# EasyEDA Pro project f407拓展.eprj

# Schematic Schematic1
Create Date: 2024-04-14; Page Name: P1; Project Name: f407拓展; Schematic Name: Schematic1; Update Date: 2024-04-14; Company: 嘉立创EDA; Page Size: A4; Version: V1.0
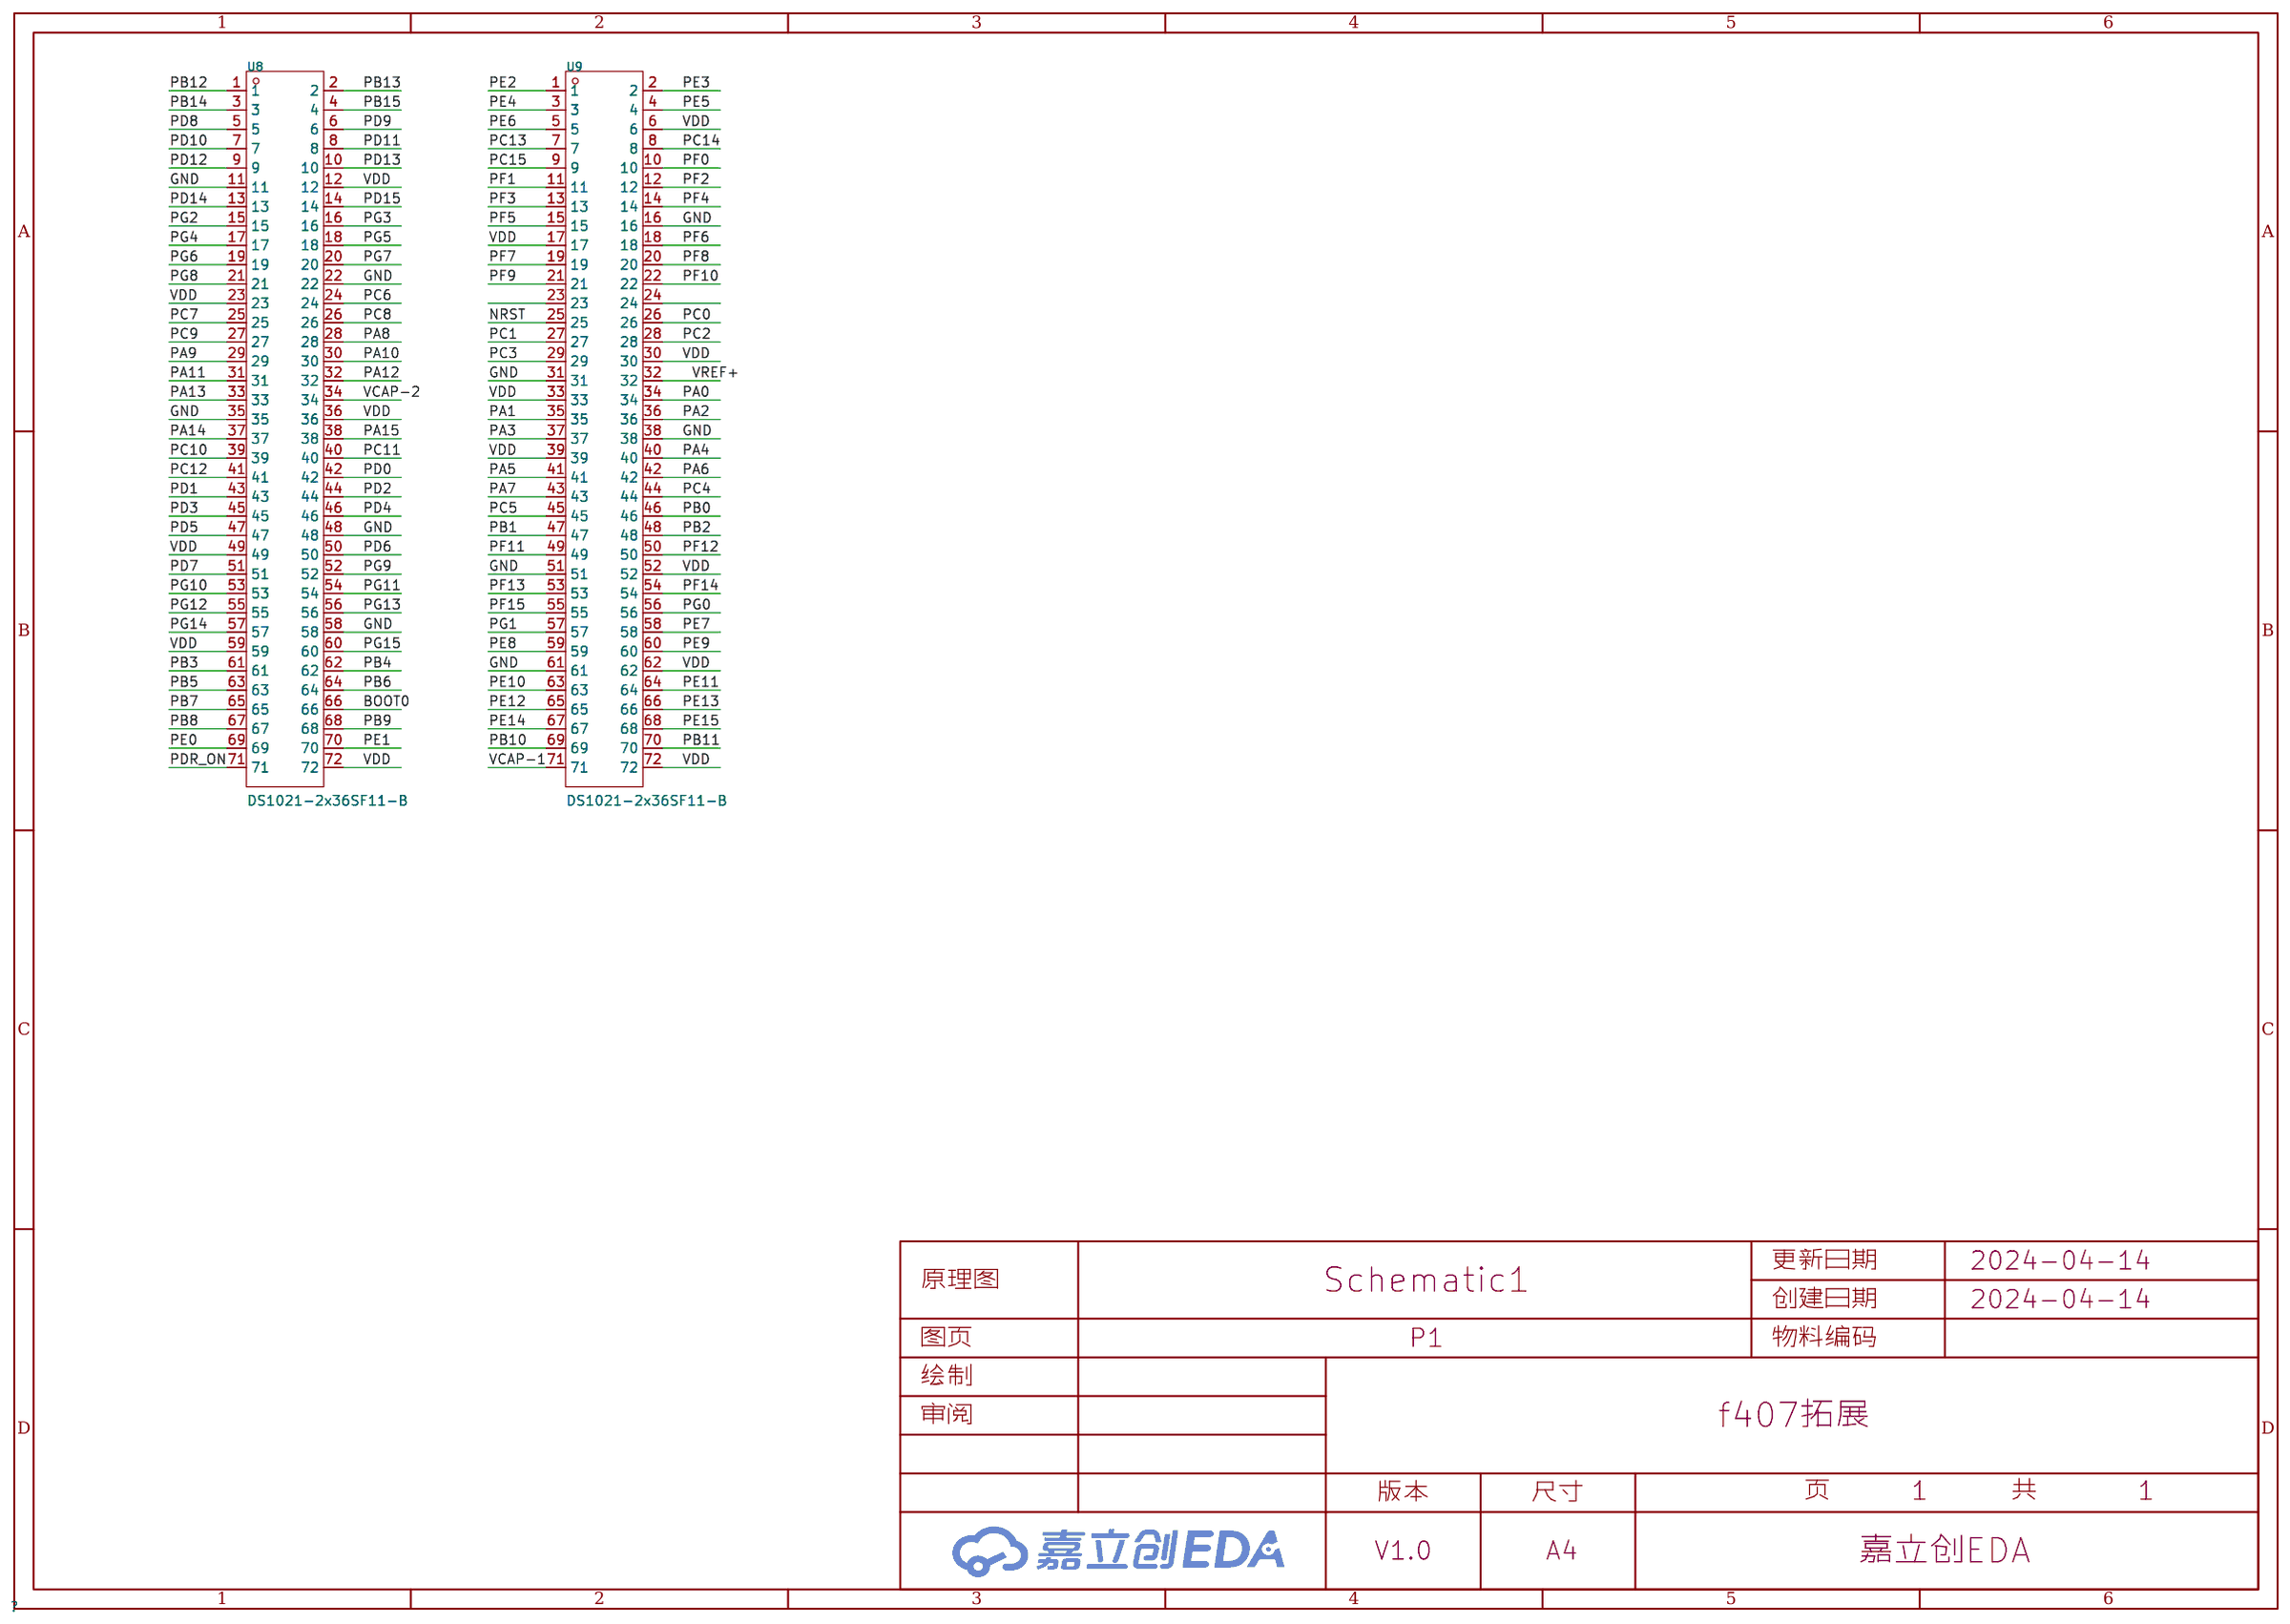
[diagram p0: schematic sheet]

## Parts
U8  DS1021-2x36SF11-B  [HDR-TH_72P-P2.54-V-M-R2-C36-S2.54]
U9  DS1021-2x36SF11-B  [HDR-TH_72P-P2.54-V-M-R2-C36-S2.54]

## Library data of the parts
U8 U9 = DS1021-2x36SF11-B: 插针结构:2x36P;间距:2.54mm;安装类型:直插;排数:双排;总PIN位数:72P;; LCSC Part Name: 2x36P 间距:2.54mm 直插; Supplier Part: C7430432; Manufacturer: CONNFLY; Supplier Footprint: 插件,P=2.54mm; Datasheet: https://atta.szlcsc.com/upload/public/pdf/source/20230721/045F128FE19DC325F71FA0C1C07679E3.pdf; Supplier: LCSC; Pin Structure: 2x36P; Pitch: 2.54mm; Mounting Type: 直插; Number of Rows: 双排; Number of Pins: 72P

## Nets
GND: U8.11 U8.22 U8.35 U8.48 U8.58 U9.16 U9.31 U9.38 U9.51 U9.61
VDD: U8.12 U8.23 U8.36 U8.49 U8.59 U8.72 U9.6 U9.17 U9.30 U9.33 U9.39 U9.52 U9.62 U9.72
BOOT0: U8.66
NRST: U9.25
PA0: U9.34
PA1: U9.35
PA2: U9.36
PA3: U9.37
PA4: U9.40
PA5: U9.41
PA6: U9.42
PA7: U9.43
PA8: U8.28
PA9: U8.29
PA10: U8.30
PA11: U8.31
PA12: U8.32
PA13: U8.33
PA14: U8.37
PA15: U8.38
PB0: U9.46
PB1: U9.47
PB2: U9.48
PB3: U8.61
PB4: U8.62
PB5: U8.63
PB6: U8.64
PB7: U8.65
PB8: U8.67
PB9: U8.68
PB10: U9.69
PB11: U9.70
PB12: U8.1
PB13: U8.2
PB14: U8.3
PB15: U8.4
PC0: U9.26
PC1: U9.27
PC2: U9.28
PC3: U9.29
PC4: U9.44
PC5: U9.45
PC6: U8.24
PC7: U8.25
PC8: U8.26
PC9: U8.27
PC10: U8.39
PC11: U8.40
PC12: U8.41
PC13: U9.7
PC14: U9.8
PC15: U9.9
PD0: U8.42
PD1: U8.43
PD2: U8.44
PD3: U8.45
PD4: U8.46
PD5: U8.47
PD6: U8.50
PD7: U8.51
PD8: U8.5
PD9: U8.6
PD10: U8.7
PD11: U8.8
PD12: U8.9
PD13: U8.10
PD14: U8.13
PD15: U8.14
PDR_ON: U8.71
PE0: U8.69
PE1: U8.70
PE2: U9.1
PE3: U9.2
PE4: U9.3
PE5: U9.4
PE6: U9.5
PE7: U9.58
PE8: U9.59
PE9: U9.60
PE10: U9.63
PE11: U9.64
PE12: U9.65
PE13: U9.66
PE14: U9.67
PE15: U9.68
PF0: U9.10
PF1: U9.11
PF2: U9.12
PF3: U9.13
PF4: U9.14
PF5: U9.15
PF6: U9.18
PF7: U9.19
PF8: U9.20
PF9: U9.21
PF10: U9.22
PF11: U9.49
PF12: U9.50
PF13: U9.53
PF14: U9.54
PF15: U9.55
PG0: U9.56
PG1: U9.57
PG2: U8.15
PG3: U8.16
PG4: U8.17
PG5: U8.18
PG6: U8.19
PG7: U8.20
PG8: U8.21
PG9: U8.52
PG10: U8.53
PG11: U8.54
PG12: U8.55
PG13: U8.56
PG14: U8.57
PG15: U8.60
VCAP-1: U9.71
VCAP-2: U8.34
VREF+: U9.32

Not connected (* = marked no-connect by the designer): U9 23 24

# Board PCB1
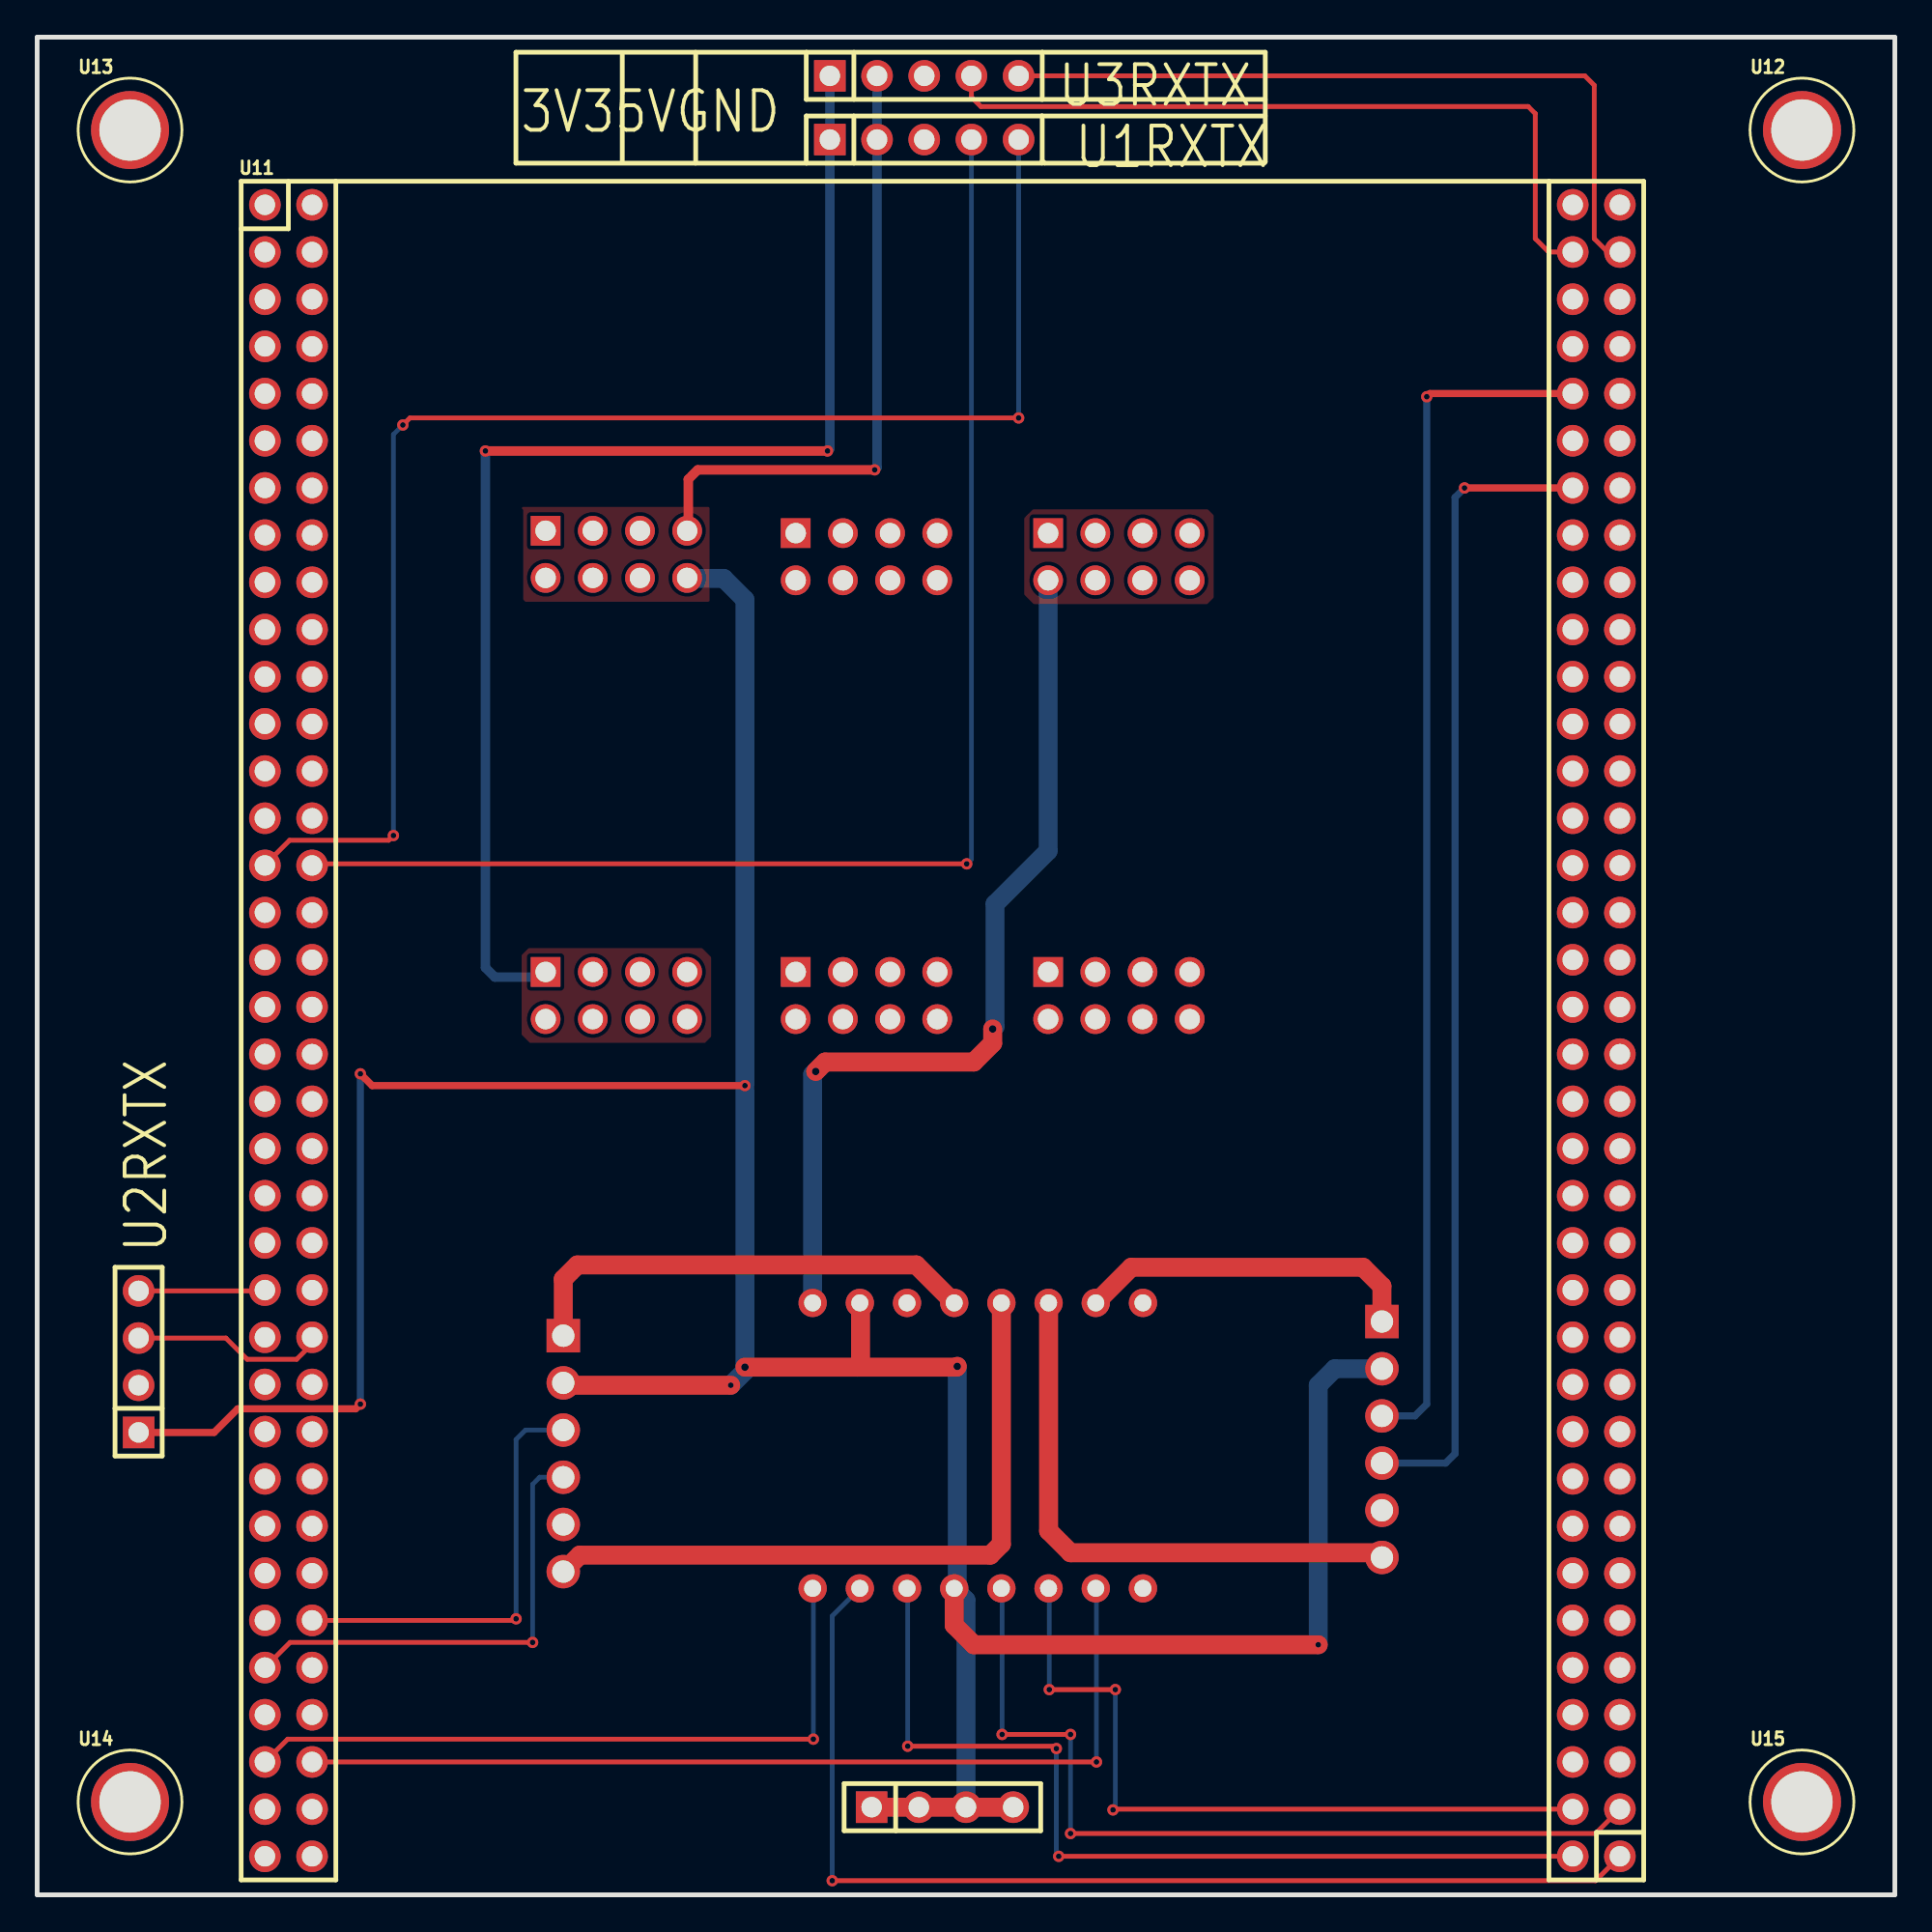
[diagram p1: board, top side]
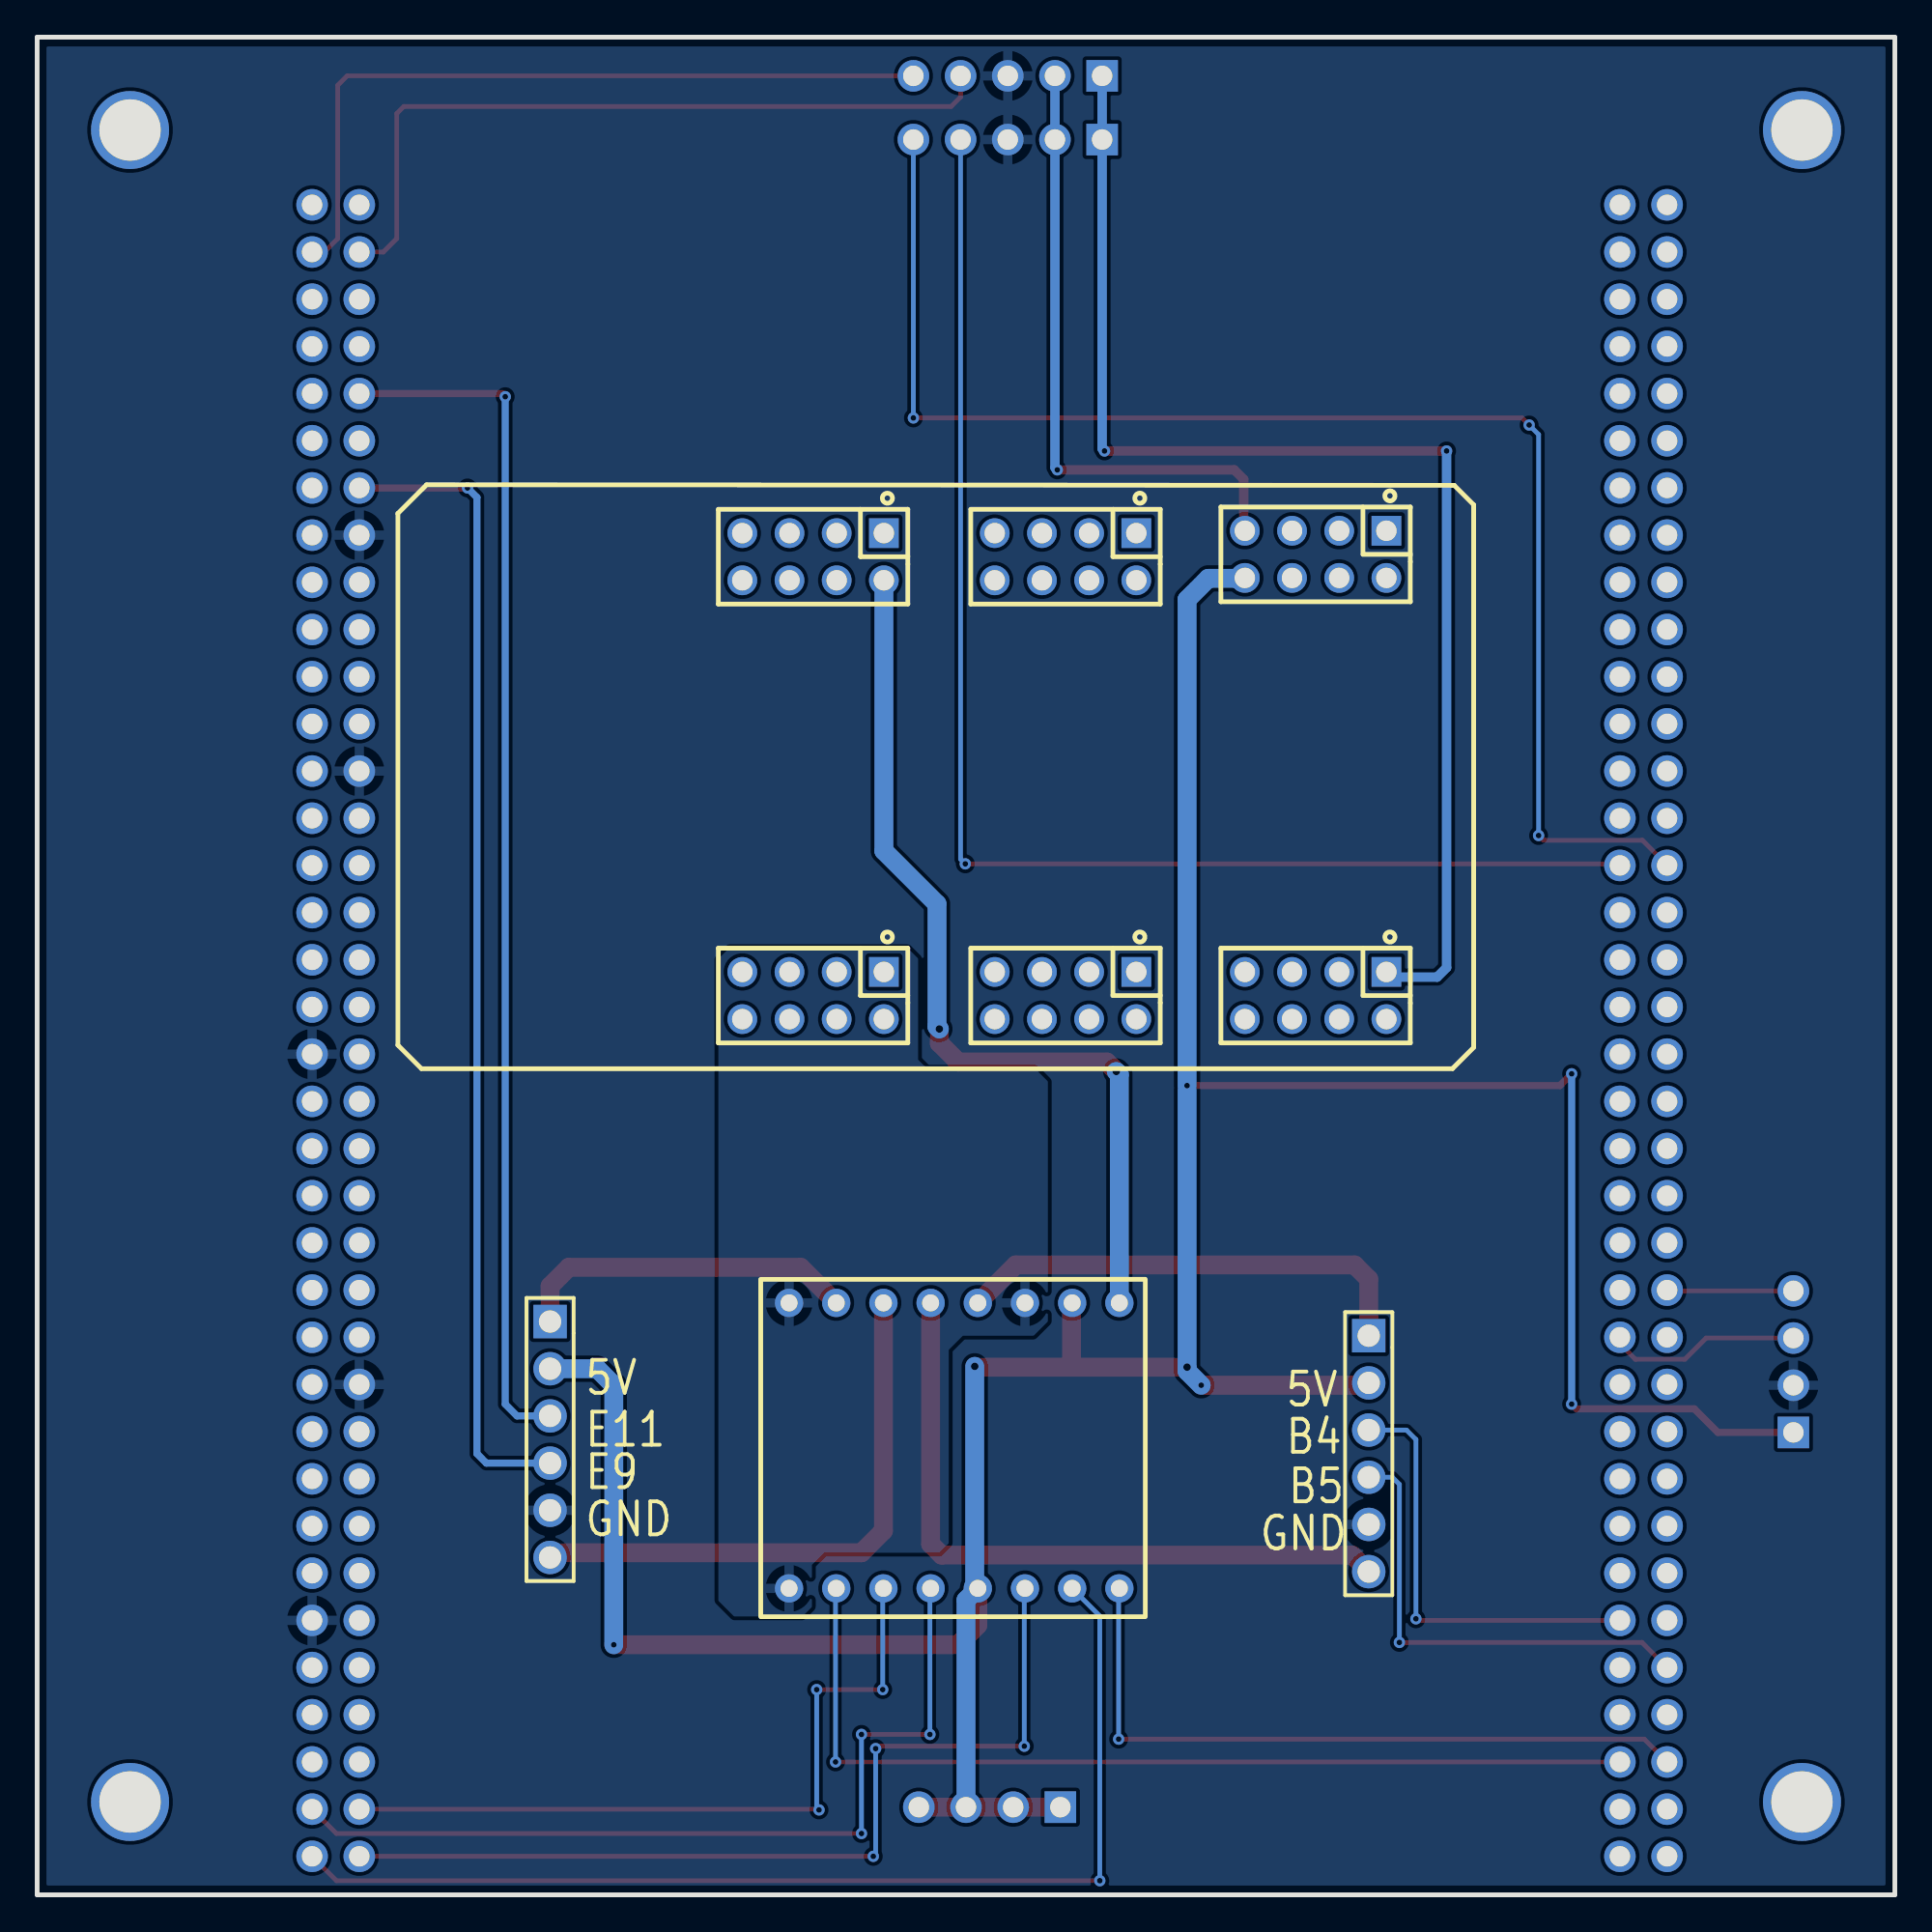
[diagram p2: board, bottom side, seen from below]

Outline 100 x 100 mm; copper layers: Top Layer, Bottom Layer. Coordinates in mm from the lower left corner of the outline.
Outline path: 0,100 100,100 100,0 0,0 0,100
Stack: Top Layer 0.035mm / Dielectric1 1.51mm FR4 er 4.5 / Bottom Layer 0.035mm

## Design rules (mm)
template: 自定义配置
spacing copperThickness1oz (default): track to track 0.102, other pairs 0.152 to 0.3
spacing copperThickness2oz: track to track 0.203, other pairs 0.152 to 0.3
track width copperThickness1oz (default): min 0.127, default 0.254, max 2.54
track width copperThickness2oz: min 0.203, default 0.254, max 2.54
differential pair differentialPair (default): width min 0.127, default 0.254, max 2.54; gap min 0.152, default 0.152
via viaSize (default): diameter min 0.5, default 0.61, max 10; hole min 0.3, default 0.305, max 6.3

## Placement (name value [footprint] x y rotation side)
H1  -  [HDR-TH_4P-P2.54-V-M]  5.46 28.7 90 top
H2  -  [HDR-TH_6P-P2.54-V-M-1]  28.32 23.75 270 bottom
H3  -  [HDR-TH_6P-P2.54-V-M-1]  72.39 24.51 270 bottom
H4  -  [HDR-TH_5P-P2.54-V-M]  47.75 97.92 0 top
H5  -  [HDR-TH_5P-P2.54-V-M]  47.75 94.49 0 top
U9  DS1021-2x36SF11-B  [TB6612]  50 24.75 270 bottom
U10  -  [电源v2.0]  50 60.2 180 bottom
U11  -  [f407]  50 45 0 top
U12  M3*12+3  [TH_BD4.7-D3.0]  95 95 0 top
U13  M3*12+3  [TH_BD4.7-D3.0]  5 95 0 top
U14  M3*12+3  [TH_BD4.7-D3.0]  5 5 0 top
U15  M3*12+3  [TH_BD4.7-D3.0]  95 5 0 top

## Footprints (pads in the part's own frame, mm; a bottom-side part is the same pattern mirrored in y, then rotated)
f407
  round 1.7 hole 1.1: 1(-37.74,45.974) 1(35.2,-42.926) 2(-35.2,45.974) 2(-2.54,-40.281) 2(32.66,-42.926) 3(-37.74,43.434) 3(0,-40.281) 3(35.2,-40.386) 4(-35.2,43.434) 4(2.54,-40.281) 4(32.66,-40.386) 5(-37.74,40.894) 5(35.2,-37.846) 6(-35.2,40.894) 6(32.66,-37.846) 7(-37.74,38.354) 7(35.2,-35.306) 8(-35.2,38.354) 8(32.66,-35.306) 9(-37.74,35.814) 9(35.2,-32.766) 10(-35.2,35.814) 10(32.66,-32.766) 11(-37.74,33.274) 11(35.2,-30.226) 12(-35.2,33.274) 12(32.66,-30.226) 13(-37.74,30.734) 13(35.2,-27.686) 14(-35.2,30.734) 14(32.66,-27.686) 15(-37.74,28.194) 15(35.2,-25.146) 16(-35.2,28.194) 16(32.66,-25.146) 17(-37.74,25.654) 17(35.2,-22.606) 18(-35.2,25.654) 18(32.66,-22.606) 19(-37.74,23.114) 19(35.2,-20.066) 20(-35.2,23.114) 20(32.66,-20.066) 21(-37.74,20.574) 21(35.2,-17.526) 22(-35.2,20.574) 22(32.66,-17.526) 23(-37.74,18.034) 23(35.2,-14.986) 24(-35.2,18.034) 24(32.66,-14.986) 25(-37.74,15.494) 25(35.2,-12.446) 26(-35.2,15.494) 26(32.66,-12.446) 27(-37.74,12.954) 27(35.2,-9.906) 28(-35.2,12.954) 28(32.66,-9.906) 29(-37.74,10.414) 29(35.2,-7.366) 30(-35.2,10.414) 30(32.66,-7.366) 31(-37.74,7.874) 31(35.2,-4.826) 32(-35.2,7.874) 32(32.66,-4.826) 33(-37.74,5.334) 33(35.2,-2.286) 34(-35.2,5.334) 34(32.66,-2.286) 35(-37.74,2.794) 35(35.2,0.254) 36(-35.2,2.794) 36(32.66,0.254) 37(-37.74,0.254) 37(35.2,2.794) 38(-35.2,0.254) 38(32.66,2.794) 39(-37.74,-2.286) 39(35.2,5.334) 40(-35.2,-2.286) 40(32.66,5.334) 41(-37.74,-4.826) 41(35.2,7.874) 42(-35.2,-4.826) 42(32.66,7.874) 43(-37.74,-7.366) 43(35.2,10.414) 44(-35.2,-7.366) 44(32.66,10.414) 45(-37.74,-9.906) 45(35.2,12.954) 46(-35.2,-9.906) 46(32.66,12.954) 47(-37.74,-12.446) 47(35.2,15.494) 48(-35.2,-12.446) 48(32.66,15.494) 49(-37.74,-14.986) 49(35.2,18.034) 50(-35.2,-14.986) 50(32.66,18.034) 51(-37.74,-17.526) 51(35.2,20.574) 52(-35.2,-17.526) 52(32.66,20.574) 53(-37.74,-20.066) 53(35.2,23.114) 54(-35.2,-20.066) 54(32.66,23.114) 55(-37.74,-22.606) 55(35.2,25.654) 56(-35.2,-22.606) 56(32.66,25.654) 57(-37.74,-25.146) 57(35.2,28.194) 58(-35.2,-25.146) 58(32.66,28.194) 59(-37.74,-27.686) 59(35.2,30.734) 60(-35.2,-27.686) 60(32.66,30.734) 61(-37.74,-30.226) 61(35.2,33.274) 62(-35.2,-30.226) 62(32.66,33.274) 63(-37.74,-32.766) 63(35.2,35.814) 64(-35.2,-32.766) 64(32.66,35.814) 65(-37.74,-35.306) 65(35.2,38.354) 66(-35.2,-35.306) 66(32.66,38.354) 67(-37.74,-37.846) 67(35.2,40.894) 68(-35.2,-37.846) 68(32.66,40.894) 69(-37.74,-40.386) 69(35.2,43.434) 70(-35.2,-40.386) 70(32.66,43.434) 71(-37.74,-42.926) 71(35.2,45.974) 72(-35.2,-42.926) 72(32.66,45.974)
  rect 1.7x1.7 hole 1.1: 1(-5.08,-40.281)
HDR-TH_4P-P2.54-V-M
  rect 1.7x1.7 hole 1.1: 1(-3.81,0)
  round 1.7 hole 1.1: 2(-1.27,0) 3(1.27,0) 4(3.81,0)
HDR-TH_5P-P2.54-V-M
  rect 1.7x1.7 hole 1.1: 1(-5.08,0)
  round 1.7 hole 1.1: 2(-2.54,0) 3(0,0) 4(2.54,0) 5(5.08,0)
HDR-TH_6P-P2.54-V-M-1
  rect 1.8x1.8 hole 1.2: 1(-6.35,0)
  round 1.8 hole 1.2: 2(-3.81,0) 3(-1.27,0) 4(1.27,0) 5(3.81,0) 6(6.35,0)
TB6612
  round 1.524 hole 0.914: 1(-7.112,8.255) 2(-7.112,5.715) 3(-7.112,3.175) 4(-7.112,0.635) 5(-7.112,-1.905) 6(-7.112,-4.445) 7(-7.112,-6.985) 8(-7.112,-9.525) 9(8.255,-9.525) 10(8.255,-6.985) 11(8.255,-4.445) 12(8.255,-1.905) 13(8.255,0.635) 14(8.255,3.175) 15(8.255,5.715) 16(8.255,8.255)
TH_BD4.7-D3.0
  round 4.2 hole 3.3: 1(0,0)
电源v2.0
  rect 1.6x1.6 hole 1.1: 1(-4.421,-10.518) 1(-4.421,13.104) 1(9.168,-10.518) 1(9.168,13.104) 1(22.63,-10.518) 1(22.63,13.232)
  round 1.6 hole 1.1: 2(-4.421,-13.057) 2(-4.421,10.565) 2(9.168,-13.057) 2(9.168,10.565) 2(22.63,-13.057) 2(22.63,10.691) 3(-6.962,-10.518) 3(-6.962,13.104) 3(6.628,-10.518) 3(6.628,13.104) 3(20.09,-10.518) 3(20.09,13.232) 4(-6.962,-13.057) 4(-6.962,10.565) 4(6.628,-13.057) 4(6.628,10.565) 4(20.09,-13.057) 4(20.09,10.691) 5(-9.502,-10.518) 5(-9.502,13.104) 5(4.088,-10.518) 5(4.088,13.104) 5(17.549,-10.518) 5(17.549,13.232) 6(-9.502,-13.057) 6(-9.502,10.565) 6(4.088,-13.057) 6(4.088,10.565) 6(17.549,-13.057) 6(17.549,10.691) 7(-12.041,-10.518) 7(-12.041,13.104) 7(1.548,-10.518) 7(1.548,13.104) 7(15.009,-10.518) 7(15.009,13.232) 8(-12.041,-13.057) 8(-12.041,10.565) 8(1.548,-13.057) 8(1.548,10.565) 8(15.009,-13.057) 8(15.009,10.691)

## Nets
3V3: H4.1 H5.1
5V: H1.1 H2.2 H3.2 H4.2 H5.2 U9.2 U9.13 U10.1 U10.2 U10.3 U10.4 U10.5 U10.6 U10.7 U10.8 U11.1 U11.2 U11.3 U11.4
GND: H1.2 H2.5 H3.5 H4.3 H5.3 U11.11 U11.22 U11.35 U11.48 U11.58
PGND: U9.3 U9.8 U9.9
VCC: U9.1
AO1: H2.1 U9.4
AO2: H2.6 U9.5
BO1: H3.1 U9.7
BO2: H3.6 U9.6
PB4: H2.3 U11.62
PB5: H2.4 U11.63
PB8: U9.16 U11.67
PB9: U9.10 U11.68
PE2: U9.15
PE3: U9.14
PE4: U9.12
PE5: U9.11
PE9: H3.4
PE11: H3.3
U1RX: H5.4 U11.30
U1TX: H5.5 U11.29
U2RX: H1.3 U11.50
U2TX: H1.4 U11.47
U3RX: H4.4
U3TX: H4.5

Pads without a net: U11 5 6 7 8 9 10 12 13 14 15 16 17 18 19 20 21 23 24 25 26 27 28 31 32 33 34 36 37 38 39 40 41 42 43 44 45 46 49 51 52 53 54 55 56 57 59 60 61 64 65 66 69 70 71 72; U12 1; U13 1; U14 1; U15 1

## Via types
v1: diameter 0.965, hole 0.406, Top Layer to Bottom Layer, 4 vias
v2: diameter 0.61, hole 0.305, Top Layer to Bottom Layer, 28 vias

## Routing (per net, layer and track width the routed paths; a pad name or vN(x,y) marks a point on that pad's centre or on a via; arc(x,y) is an arc through that point)
3V3: length 70
  Top Layer w0.508: v2(42.54,77.72) v2(24.13,77.72)
  Bottom Layer w0.508: v2(24.13,77.72) 24.13,49.91 24.64,49.4 27.09,49.4 27.37,49.68 ; H4.1 H5.1 42.67,77.85 v2(42.54,77.72)
5V: length 227.1
  Top Layer w0.381: v2(38.1,43.56) 18.03,43.56 v2(17.4,44.2) ; H1.1 9.53,24.89 10.8,26.16 17.14,26.16 v2(17.4,26.42)
  Top Layer w0.508: U10.7 35.05,73.49 35.05,76.2 35.56,76.71 v2(45.09,76.71)
  Top Layer w1.016: 44.28,31.87 44.32,31.83 44.32,28.57 44.15,28.41 ; U11.1 U11.2 U11.3 U11.4 ; v1(49.53,28.45) 49.49,28.41 44.15,28.41 ; H2.2 28.45,27.43 v2(37.34,27.43) ; 44.15,28.41 v1(38.1,28.41) ; U9.13 49.37,14.52 50.42,13.46 v2(68.96,13.46)
  Bottom Layer w0.381: v2(17.4,44.2) v2(17.4,26.42)
  Bottom Layer w0.508: H4.2 H5.2 45.21,76.83 v2(45.09,76.71)
  Bottom Layer w1.016: v2(68.96,13.46) 68.96,27.43 69.85,28.32 H3.2 ; U11.3 50,15.86 U9.13 49.53,16.66 v1(49.53,28.45) ; 38.1,43.31 v1(38.1,28.41) 38.1,28.19 v2(37.34,27.43) ; v2(38.1,43.56) 38.1,69.72 36.96,70.87 35.01,70.87 U10.8
VCC: length 48.8
  Top Layer w1.016: v1(51.44,46.61) 51.44,45.85 50.42,44.83 42.42,44.83 v1(41.91,44.32)
  Bottom Layer w1.016: v1(41.91,44.32) 41.75,44.16 41.75,31.87 ; v1(51.44,46.61) 51.56,46.74 51.56,53.34 54.42,56.2 54.42,70.76
AO1: length 25.3
  Top Layer w1.016: 49.37,31.87 47.32,33.91 29.08,33.91 28.32,33.15 H2.1
AO2: length 37.2
  Top Layer w1.016: H2.6 29.21,18.29 51.31,18.29 51.91,18.88 51.91,31.87
BO1: length 18.5
  Top Layer w1.016: H3.1 72.39,32.77 71.37,33.78 58.9,33.78 56.99,31.87
BO2: length 30.8
  Top Layer w1.016: 54.44,31.87 54.44,19.6 55.63,18.41 72.14,18.41 H3.6
PB4: length 23.4
  Top Layer w0.254: v2(25.78,14.86) 25.7,14.77 U11.62
  Bottom Layer w0.254: H2.3 26.29,25.02 25.78,24.51 v2(25.78,14.86)
PB5: length 25.3
  Top Layer w0.254: v2(26.67,13.59) 13.61,13.59 U11.63
  Bottom Layer w0.254: v2(26.67,13.59) 26.67,22.1 27.05,22.48 28.32,22.48
PB8: length 38.2
  Top Layer w0.254: U11.67 13.49,8.38 v2(41.78,8.38)
  Bottom Layer w0.254: v2(41.78,8.38) 41.78,16.46 U9.16
PB9: length 51.6
  Top Layer w0.254: U11.68 v2(57.02,7.15)
  Bottom Layer w0.254: U9.10 57.02,16.46 v2(57.02,7.15)
PE2: length 59.3
  Top Layer w0.254: 85.2,2.07 83.89,0.76 v2(42.8,0.76)
  Bottom Layer w0.254: v2(42.8,0.76) 42.8,15.01 U9.15
PE3: length 50.1
  Top Layer w0.254: v2(54.86,7.87) 54.74,8 v2(46.86,8) ; 82.66,2.07 v2(54.99,2.07)
  Bottom Layer w0.254: U9.14 46.86,16.46 v2(46.86,8) ; v2(54.86,7.87) 54.86,2.2 v2(54.99,2.07)
PE4: length 47
  Top Layer w0.254: 85.2,4.61 83.89,3.3 v2(55.63,3.3) ; v2(55.63,8.64) v2(51.94,8.64)
  Bottom Layer w0.254: v2(55.63,3.3) v2(55.63,8.64) ; v2(51.94,8.64) 51.94,16.46
PE5: length 40.3
  Top Layer w0.254: 82.66,4.61 57.95,4.61 v2(57.91,4.57) ; v2(58.04,11.05) v2(54.48,11.05)
  Bottom Layer w0.254: v2(58.04,11.05) 58.04,4.7 v2(57.91,4.57) ; U9.11 54.48,16.46 v2(54.48,11.05)
PE9: length 62.2
  Top Layer w0.381: 82.66,75.73 v2(76.84,75.73)
  Bottom Layer w0.381: H3.4 75.82,23.24 76.33,23.75 76.33,75.23 v2(76.84,75.73)
PE11: length 64.8
  Top Layer w0.381: v2(74.8,80.64) 74.97,80.81 82.66,80.81
  Bottom Layer w0.381: v2(74.8,80.64) 74.8,26.42 74.17,25.78 H3.3
U1RX: length 74.4
  Top Layer w0.254: v2(50.04,55.5) 14.89,55.5 U11.30
  Bottom Layer w0.254: H5.4 50.29,55.75 v2(50.04,55.5)
U1TX: length 78.2
  Top Layer w0.254: U11.29 12.26,55.44 13.59,56.77 18.92,56.77 v2(19.18,57.02) ; v2(52.83,79.5) 20.07,79.5 v2(19.69,79.12)
  Bottom Layer w0.254: v2(52.83,79.5) H5.5 ; v2(19.18,57.02) 19.18,78.61 v2(19.69,79.12)
U2RX: length 10.5
  Top Layer w0.254: U11.50 14.8,29.66 13.97,28.83 11.3,28.83 10.16,29.97 H1.3
U2TX: length 6.8
  Top Layer w0.254: H1.4 12.22,32.51 U11.47
U3RX: length 40.9
  Top Layer w0.254: 82.66,88.43 81.37,88.43 80.65,89.15 80.65,95.89 80.26,96.27 50.8,96.27 50.29,96.77 H4.4
U3TX: length 41.1
  Top Layer w0.254: H4.5 83.31,97.92 83.82,97.41 83.82,89.15 84.54,88.43 85.2,88.43

## Copper pours and planes (outline as drawn; the poured copper is in the pictures)
3V3 on Top Layer: 35.8,50.96 36.28,50.48 36.28,46.19 35.95,45.86 26.52,45.86 26.08,46.3 26.08,50.59 26.45,50.96
5V on Top Layer: 36.16,74.71 36.19,74.68 36.19,69.61 26.28,69.61 26.16,69.72 26.16,74.55 26.03,74.68 26.07,74.71
GND on Bottom Layer: 45.97,105.66 101.98,105.66 109.85,97.79 109.85,1.91 99.06,-8.89 -4.57,-8.89 -19.81,6.35 -19.81,98.3 -10.29,107.82 43.81,107.82
PGND on Bottom Layer: 62.75,50.96 63.33,50.38 63.33,15.83 62.48,14.99 58.8,14.99 58.29,15.49 58.29,17.76 57.64,18.41 51.44,18.41 50.93,18.92 50.93,29.34 50.16,30.1 46.35,30.1 45.59,30.86 45.59,43.79 46.27,44.47 52.09,44.47 52.58,44.96 52.58,50.41 53.13,50.96
VCC on Top Layer: 63.01,74.58 63.33,74.27 63.33,69.83 62.98,69.48 53.65,69.48 53.13,70 53.13,74.11 53.6,74.58

## Text on the board
Bottom Silkscreen Layer: B5 | B4 | GND | 5V | E11 | E9
Top Silkscreen Layer: 3V35VGND | U3RXTX | U1RXTX | U2RXTX
